# EAGLE schematic Temperature Beeper (EAGLE 9.5.2)
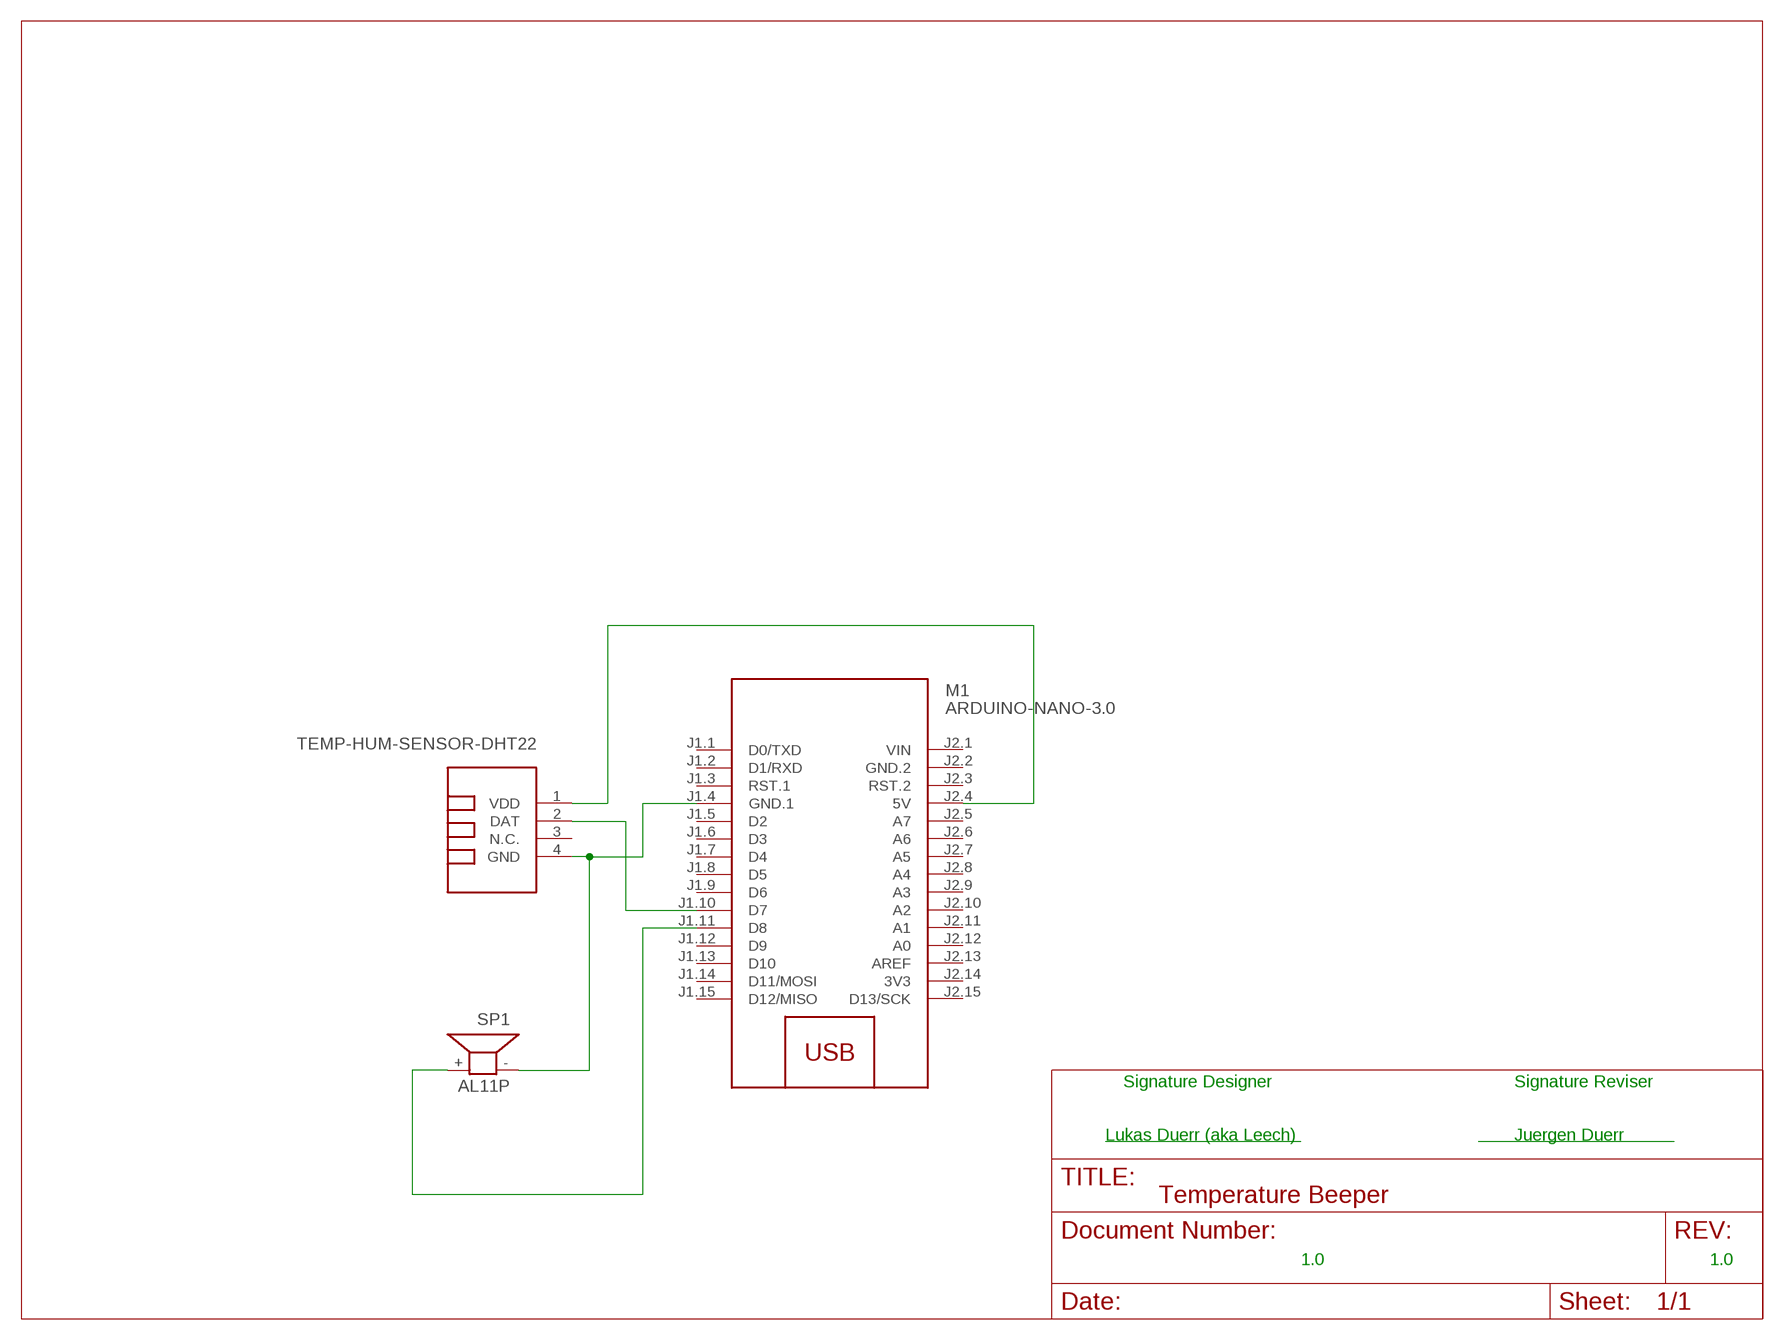
[diagram p0: schematic, sheet 1]

## Parts
M1  ARDUINO-NANO-3.0  [ARDUINO-NANO-3.0]
SP1  AL11P  [AL11P]
U$2  TEMP-HUM-SENSOR-DHT22  [TEMP-HUM-SENSOR-DHT22]

## Nets
N$1: M1.J1.11(D8) SP1.+
N$2: M1.J1.4(GND.1) SP1.- U$2.4(GND)
N$3: M1.J2.4(5V) U$2.1(VDD)
N$5: M1.J1.10(D7) U$2.2(DAT)
Unconnected: M1.J1.1(D0/TXD) M1.J1.2(D1/RXD) M1.J1.3(RST.1) M1.J1.5(D2) M1.J1.6(D3) M1.J1.7(D4) M1.J1.8(D5) M1.J1.9(D6) M1.J1.12(D9) M1.J1.13(D10) M1.J1.14(D11/MOSI) M1.J1.15(D12/MISO) M1.J2.3(RST.2) M1.J2.5(A7) M1.J2.6(A6) M1.J2.7(A5) M1.J2.8(A4) M1.J2.9(A3) M1.J2.10(A2) M1.J2.11(A1) M1.J2.12(A0) M1.J2.13(AREF) M1.J2.15(D13/SCK) U$2.3(N.C.)

## Notes on the sheet
- Signature Designer | Signature Reviser
- Lukas Duerr (aka Leech) | Juergen Duerr
- 1.0 | 1.0

## Power pins joined to a net without a drawn wire
3V3: M1.J2.14(3V3)
GND.2: M1.J2.2(GND.2)
VIN: M1.J2.1(VIN)

## Library data of the parts
M1 = diy-modules:ARDUINO-NANO-3.0: Arduino Nano 3.0
SP1 = buzzer:AL11P: SPEAKER Source: Buerklin; OC_FARNELL: unknown; OC_NEWARK: unknown
U$2 = diy-modules2:TEMP-HUM-SENSOR-DHT22: DHT22 - digital humidity & temperature sensor Also known as: AM2302 AM2302 datasheet available here: http://akizukidenshi.com/download/ds/aosong/AM2302.pdf Click here to find device on ebay.com <http://www.ebay.com/sch/dht22+digital+sensor>